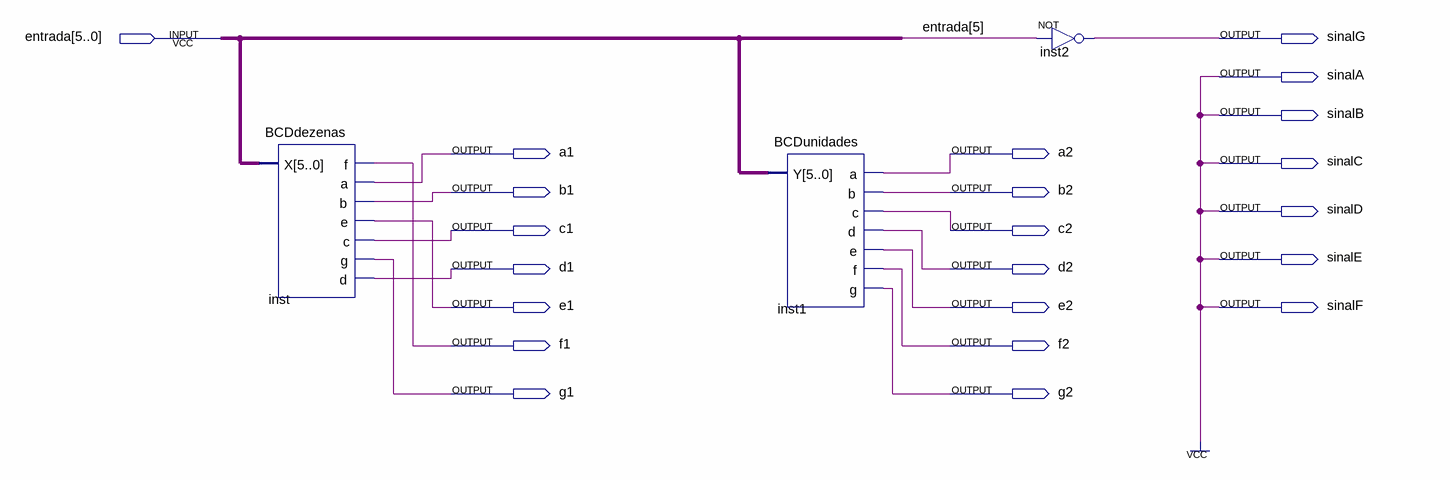
[diagram p0: schematic sheet]
// Quartus schematic moduloDisplay.bdf as structural Verilog: 3 symbols, 22 pins
module moduloDisplay (
  input  [5:0] entrada,
  output sinalG,
  output sinalA,
  output sinalB,
  output a1,
  output a2,
  output sinalC,
  output b1,
  output b2,
  output sinalD,
  output c1,
  output c2,
  output sinalE,
  output d1,
  output d2,
  output e1,
  output e2,
  output sinalF,
  output f1,
  output f2,
  output g1,
  output g2
);

  BCDdezenas inst (.X(entrada), .f(f1), .a(a1), .b(b1), .e(e1), .c(c1), .g(g1), .d(d1));
  BCDunidades inst1 (.Y(entrada), .a(a2), .b(b2), .c(c2), .d(d2), .e(e2), .f(f2), .g(g2));
  not inst2 (sinalG, entrada[5]);

  assign sinalA = 1'b1;
  assign sinalB = 1'b1;
  assign sinalC = 1'b1;
  assign sinalD = 1'b1;
  assign sinalE = 1'b1;
  assign sinalF = 1'b1;
endmodule
